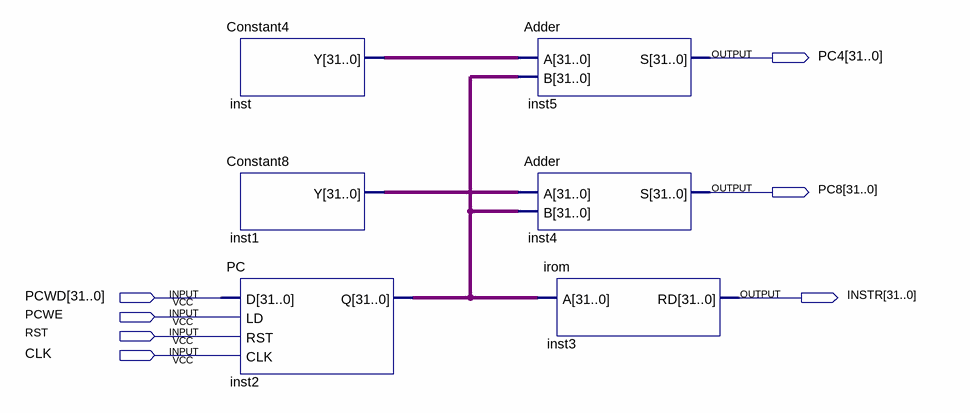
[diagram p0: schematic sheet]
// Quartus schematic Fetch.bdf as structural Verilog: 6 symbols, 7 pins
module Fetch (
  input  [31:0] PCWD,
  input  PCWE,
  input  RST,
  input  CLK,
  output [31:0] PC4,
  output [31:0] PC8,
  output [31:0] INSTR
);

  wire [31:0] inst1_y, inst2_q, inst_y;

  Constant4 inst (.Y(inst_y));
  Constant8 inst1 (.Y(inst1_y));
  PC inst2 (.D(PCWD), .LD(PCWE), .RST(RST), .CLK(CLK), .Q(inst2_q));
  Adder inst5 (.A(inst_y), .B(inst2_q), .S(PC4));
  Adder inst4 (.A(inst1_y), .B(inst2_q), .S(PC8));
  irom inst3 (.A(inst2_q), .RD(INSTR));
endmodule
